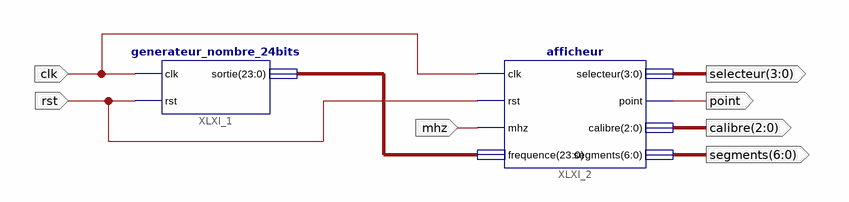
[diagram p0: schematic sheet 1]
// Xilinx ISE schematic visu_afficheur.sch (spartan3e) as structural Verilog: 2 symbols, 7 ports
module visu_afficheur (
  input  clk,
  input  rst,
  input  mhz,
  output [6:0] segments,
  output [2:0] calibre,
  output point,
  output [3:0] selecteur
);

  wire [23:0] XLXN_1;

  generateur_nombre_24bits XLXI_1 (.clk(clk), .rst(rst), .sortie(XLXN_1));
  afficheur XLXI_2 (
    .clk(clk), .rst(rst), .mhz(mhz), .frequence(XLXN_1), .selecteur(selecteur), .point(point),
    .calibre(calibre), .segments(segments));
endmodule
